# EAGLE design matrix4x4-b (EAGLE 6.6.0)
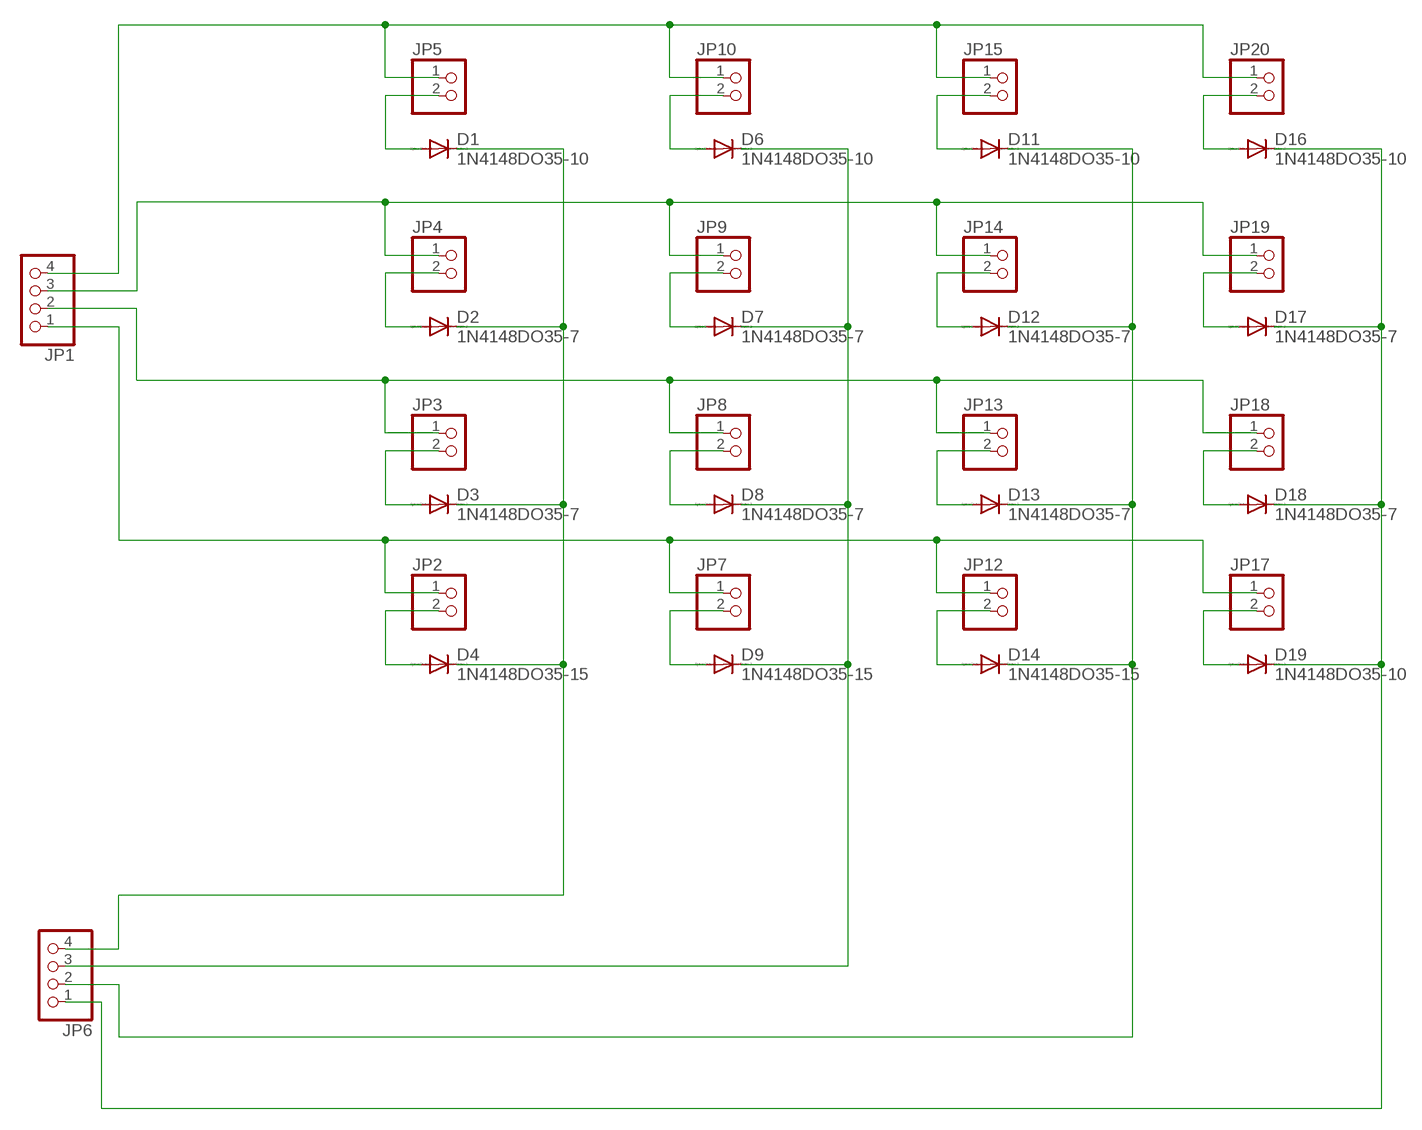
[diagram p0: schematic, sheet 1]

## Parts
D1  1N4148DO35-10  [DO35-10]
D2  1N4148DO35-7  [DO35-7]
D3  1N4148DO35-7  [DO35-7]
D4  1N4148DO35-15  [DO35-10]
D6  1N4148DO35-10  [DO35-10]
D7  1N4148DO35-7  [DO35-7]
D8  1N4148DO35-7  [DO35-7]
D9  1N4148DO35-15  [DO35-10]
D11  1N4148DO35-10  [DO35-10]
D12  1N4148DO35-7  [DO35-7]
D13  1N4148DO35-7  [DO35-7]
D14  1N4148DO35-15  [DO35-10]
D16  1N4148DO35-10  [DO35-10]
D17  1N4148DO35-7  [DO35-7]
D18  1N4148DO35-7  [DO35-7]
D19  1N4148DO35-10  [DO35-10]
JP1  PINHD-1X4  [1X04]
JP2  PINHD-1X2  [1X02]
JP3  PINHD-1X2  [1X02]
JP4  PINHD-1X2  [1X02]
JP5  PINHD-1X2  [1X02]
JP6  PINHD-1X4  [1X04]
JP7  PINHD-1X2  [1X02]
JP8  PINHD-1X2  [1X02]
JP9  PINHD-1X2  [1X02]
JP10  PINHD-1X2  [1X02]
JP12  PINHD-1X2  [1X02]
JP13  PINHD-1X2  [1X02]
JP14  PINHD-1X2  [1X02]
JP15  PINHD-1X2  [1X02]
JP17  PINHD-1X2  [1X02]
JP18  PINHD-1X2  [1X02]
JP19  PINHD-1X2  [1X02]
JP20  PINHD-1X2  [1X02]

## Nets
N$2: JP1.1 JP2.1 JP7.1 JP12.1 JP17.1
N$3: JP1.2 JP3.1 JP8.1 JP13.1 JP18.1
N$4: JP1.3 JP4.1 JP9.1 JP14.1 JP19.1
N$5: JP1.4 JP5.1 JP10.1 JP15.1 JP20.1
N$6: D1.A JP5.2
N$7: D2.A JP4.2
N$8: D4.A JP2.2
N$10: D1.C D2.C D3.C D4.C JP6.4
N$11: D6.C D7.C D8.C D9.C JP6.3
N$12: D11.C D12.C D13.C D14.C JP6.2
N$13: D16.C D17.C D18.C D19.C JP6.1
N$15: D6.A JP10.2
N$16: D7.A JP9.2
N$17: D9.A JP7.2
N$19: D3.A JP3.2
N$20: D8.A JP8.2
N$21: D13.A JP13.2
N$22: D18.A JP18.2
N$24: D11.A JP15.2
N$25: D12.A JP14.2
N$26: D14.A JP12.2
N$33: D16.A JP20.2
N$34: D17.A JP19.2
N$35: D19.A JP17.2

## Library data of the parts
D1-D3 D6-D8 D11-D13 D16-D19 = diode:1N4148: DIODE high speed (Philips)
D4 D9 D14 = custom:1N4148: DIODE high speed (Philips)
JP1 JP6 = pinhead:PINHD-1X4: PIN HEADER
JP2-JP5 JP7-JP10 JP12-JP15 JP17-JP20 = pinhead:PINHD-1X2: PIN HEADER

## Board
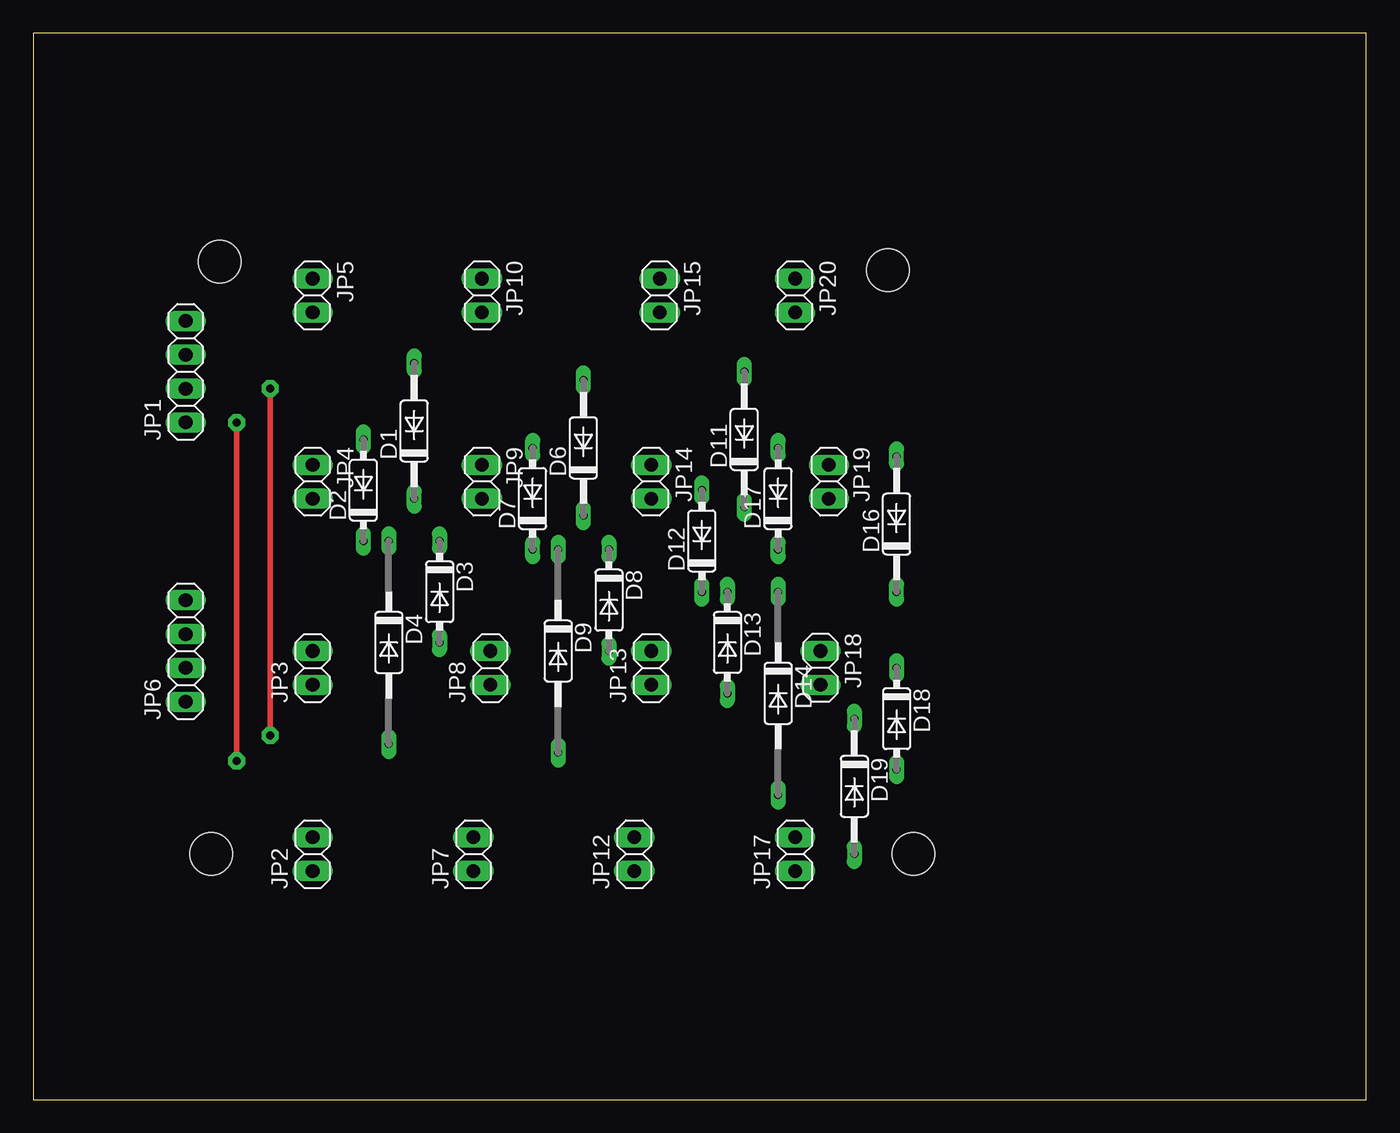
[diagram p1: board, top side]
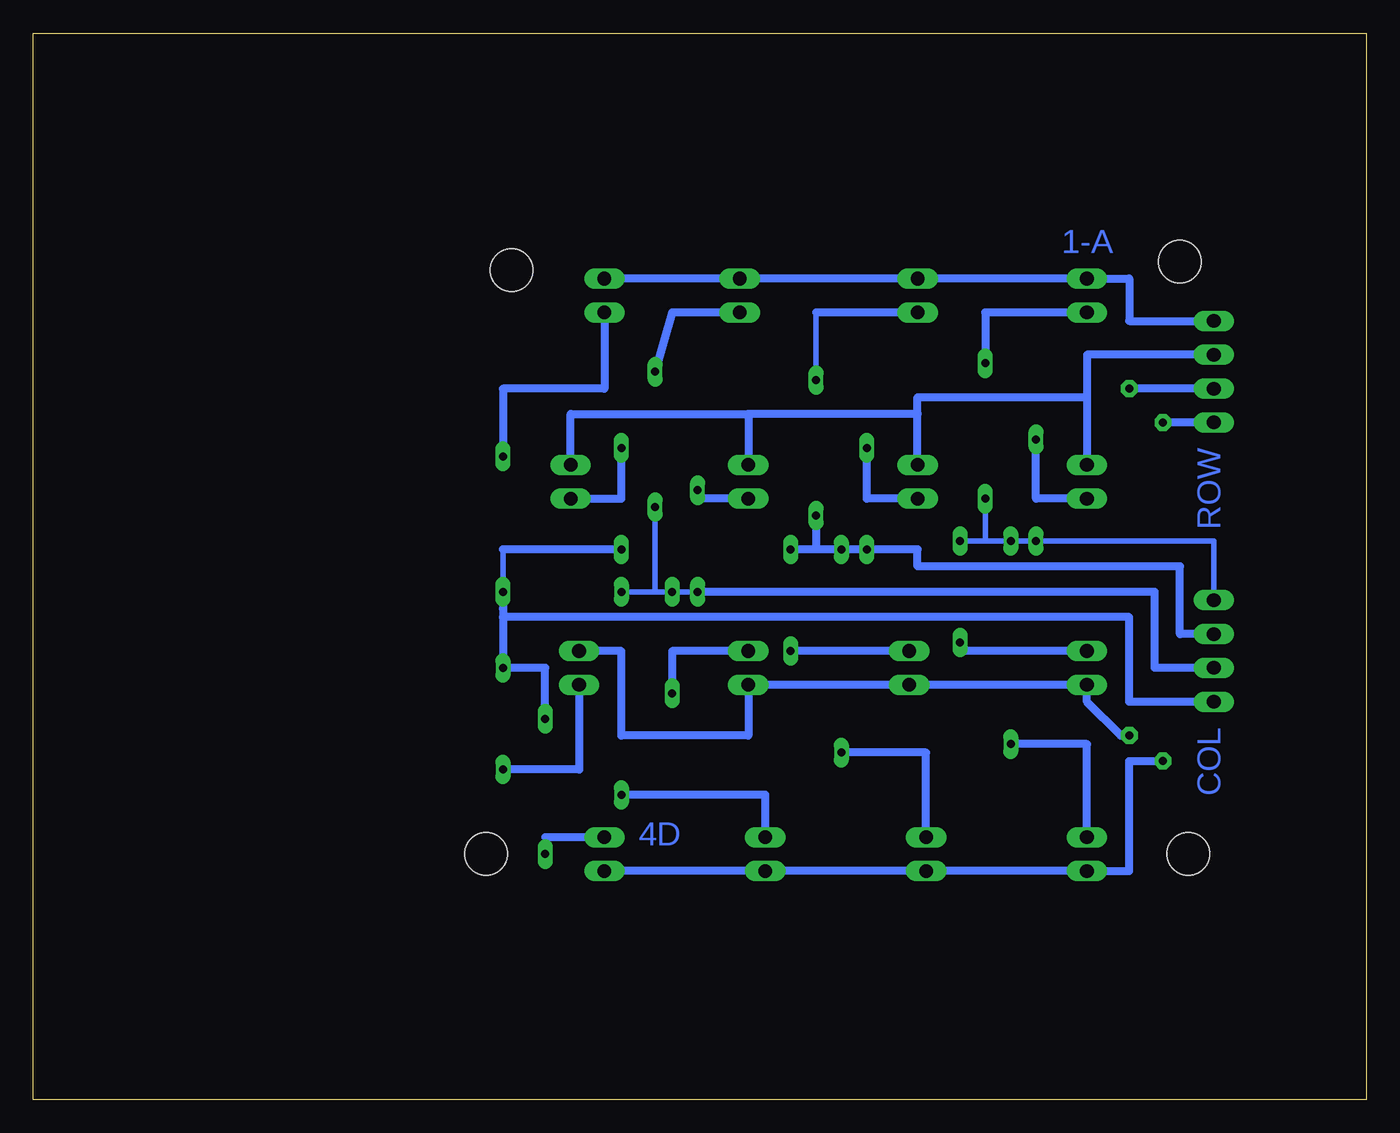
[diagram p2: board, bottom side, seen from below]

Size 100 x 80 mm. Coordinates in mm from the lower left corner, seen from the top.
Outline: 0,0 100,0 100,80 0,80 0,0
Copper layers (1*16): Top 0.035mm / dielectric 1.5mm / Bottom 0.035mm
Design rules "default *": minimum track width 10mil, minimum drill 0.6mm, track to track 8mil, track to pad 8mil, pad to pad 8mil, via to via 8mil, smd to smd 8mil, copper to edge 40mil, drill to drill 8mil, minimum pad ring 10mil, minimum via ring 8mil, stop-mask expansion 4mil, vias tented up to drill 0mil, thermal gap 10mil
Holes 3.2 mm at 13.97,62.87 13.34,18.41 64.14,62.23 66.04,18.41

### Footprints (pad centres in the part's own frame; a part is rotated, then mirrored left to right if it is on the bottom)
DO35-10 = drill 0.6 long: A 5.08,0; C -5.08,0
DO35-7 = drill 0.6 long: A 3.81,0; C -3.81,0
DO35-10' = drill 0.6 long: A 7.62,0; C -7.62,0
1X04 = drill 1.016 long: 1 -3.81,0; 2 -1.27,0; 3 1.27,0; 4 3.81,0
1X02 = drill 1.016 long: 1 -1.27,0; 2 1.27,0

### Placement (x,y rotation side)
D1  28.57,50.16 90 top
D2  24.77,45.72 90 top
D3  30.48,38.1 270 top
D4  1N4148DO35-15  [DO35-10']  26.67,34.29 270 top
D6  41.27,48.9 90 top
D7  37.47,45.09 90 top
D8  43.18,37.47 270 top
D9  1N4148DO35-15  [DO35-10']  39.37,33.66 270 top
D11  53.34,49.53 90 top
D12  50.16,41.91 90 top
D13  52.07,34.29 270 top
D14  1N4148DO35-15  [DO35-10']  55.88,30.48 270 top
D16  64.77,43.18 90 top
D17  55.88,45.09 90 top
D18  64.77,28.57 270 top
D19  61.59,23.5 270 top
JP1  11.43,54.61 90 top
JP2  20.95,18.41 90 top
JP3  20.95,32.38 90 top
JP4  20.95,46.35 270 top
JP5  20.95,60.33 270 top
JP6  11.43,33.66 90 top
JP7  33.02,18.41 90 top
JP8  34.29,32.38 90 top
JP9  33.66,46.35 270 top
JP10  33.66,60.33 270 top
JP12  45.09,18.41 90 top
JP13  46.35,32.38 90 top
JP14  46.35,46.35 270 top
JP15  46.99,60.33 270 top
JP17  57.15,18.41 90 top
JP18  59.05,32.38 270 top
JP19  59.69,46.35 270 top
JP20  57.15,60.33 270 top

### Tracks (layer width: path | path; a pad name or v marks a point on that pad's centre or on a via)
N$1
  pour Bottom (isolate 6.452): 9.53,66.04 68.58,66.04 67.94,14.61 9.53,14.61
N$2  (via drill 0.6 pad 1.27)
  Top 0.406: v15.24,25.4 v15.24,50.8
  Bottom 0.406: 45.72,17.14 JP12.1
  Bottom 0.61: JP17.1 JP12.1 JP7.1 JP2.1 17.78,17.14 17.78,25.4 v15.24,25.4 | JP1.1 v15.24,50.8
N$3  (via drill 0.6 pad 1.27)
  Top 0.406: v17.78,27.3 v17.78,53.34
  Bottom 0.406: JP3.1 20.95,30.48 | v17.78,27.3 18.41,27.3
  Bottom 0.61: JP18.1 55.88,33.66 55.88,27.3 46.35,27.3 JP13.1 JP8.1 JP3.1 20.95,29.84 18.41,27.3 | JP1.2 v17.78,53.34
N$4
  Bottom 0.61: JP1.3 20.95,55.88 20.95,52.7 | 20.95,52.7 JP4.1 | JP9.1 33.66,51.44 | 33.66,51.44 45.72,51.44 46.35,51.44 | 46.35,51.44 JP14.1 | 33.66,51.44 33.66,52.7 20.95,52.7 | JP19.1 59.69,51.44 46.35,51.44
N$5
  Bottom 0.406: 57.78,61.59 JP20.1
  Bottom 0.61: JP20.1 JP15.1 JP10.1 JP5.1 17.78,61.59 17.78,58.42 JP1.4
N$6
  Bottom 0.61: JP5.2 28.57,59.05 D1.A
N$7
  Bottom 0.61: JP4.2 24.77,45.09 D2.A
N$8
  Bottom 0.61: JP2.2 20.95,26.67 D4.A
N$9  (via drill 0.6 pad 1.27)
  other vias: 15.24,25.4
N$10
  Bottom 0.406: JP6.4 11.43,41.91 D2.C D4.C 28.57,41.91 | 28.57,41.91 D3.C | D1.C 28.57,41.91
N$11
  Bottom 0.61: JP6.3 13.97,34.92 13.97,40.01 33.66,40.01 33.66,41.27 D7.C D9.C 41.27,41.27 | 41.27,41.27 D8.C | D6.C 41.27,41.27
N$12
  Bottom 0.406: D12.C D13.C 53.34,38.1 | 53.34,38.1 D14.C | D11.C 53.34,38.1
  Bottom 0.61: JP6.2 15.88,32.38 15.88,38.1 D12.C
N$13
  Bottom 0.406: 64.77,41.27 D16.C
  Bottom 0.61: JP6.1 17.78,29.84 17.78,36.2 64.77,36.2 | D19.C 61.59,32.38 D18.C 64.77,36.2 | D17.C 64.77,41.27 | 64.77,36.2 64.77,36.83 D16.C
N$14  (via drill 0.6 pad 1.27)
  other vias: 17.78,27.3
N$15
  Bottom 0.406: 41.27,59.05 D6.A
  Bottom 0.61: JP10.2 41.27,59.05
N$16
  Bottom 0.61: JP9.2 37.47,45.09 D7.A
N$17
  Bottom 0.61: JP7.2 33.02,26.04 D9.A
N$19
  Bottom 0.406: 30.48,33.66 D3.A
  Bottom 0.61: JP3.2 30.48,33.66
N$20
  Bottom 0.61: JP8.2 D8.A
N$21
  Bottom 0.61: JP13.2 52.07,33.66 D13.A
N$22
  Bottom 0.61: JP18.2 59.05,24.77 D18.A
N$24
  Bottom 0.61: JP15.2 52.07,59.05 D11.A
N$25
  Bottom 0.61: JP14.2 50.16,45.09 D12.A
N$26
  Bottom 0.61: JP12.2 45.09,22.86 D14.A
N$33
  Bottom 0.61: JP20.2 57.15,53.34 64.77,53.34 D16.A
N$34
  Bottom 0.61: JP19.2 55.88,45.09 D17.A
N$35
  Bottom 0.406: 61.59,19.68 D19.A
  Bottom 0.61: JP17.2 61.59,19.68

### Text on the board
Bottom: 1-A | ROW | COL | 4D